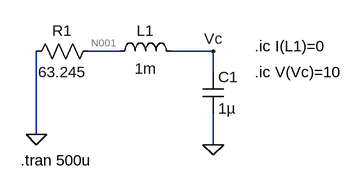
[diagram p0: schematic critically_damped.asc]
critically_damped.asc, the LTspice schematic file:
Version 4
SHEET 1 880 680
WIRE 144 96 96 96
WIRE 288 96 224 96
WIRE 288 128 288 96
WIRE 16 224 16 96
WIRE 288 240 288 192
FLAG 288 240 0
FLAG 16 224 0
FLAG 288 96 Vc
SYMBOL res 112 80 R90
WINDOW 0 0 56 VBottom 2
WINDOW 3 32 56 VTop 2
SYMATTR InstName R1
SYMATTR Value 63.245
SYMBOL ind 128 112 R270
WINDOW 0 32 56 VTop 2
WINDOW 3 5 56 VBottom 2
SYMATTR InstName L1
SYMATTR Value 1m
SYMBOL cap 272 128 R0
SYMATTR InstName C1
SYMATTR Value 1µ
TEXT 352 88 Left 2 !.ic I(L1)=0
TEXT 352 128 Left 2 !.ic V(Vc)=10
TEXT -8 264 Left 2 !.tran 500u

The netlist it stands for:
* critically_damped.asc
R1 N001 0 63.245
L1 N001 Vc 1m
C1 Vc 0 1µ
.ic I(L1)=0
.ic V(Vc)=10
.tran 500u
.backanno
.end

* Results of the author's LTspice run, read from the files saved beside the schematic
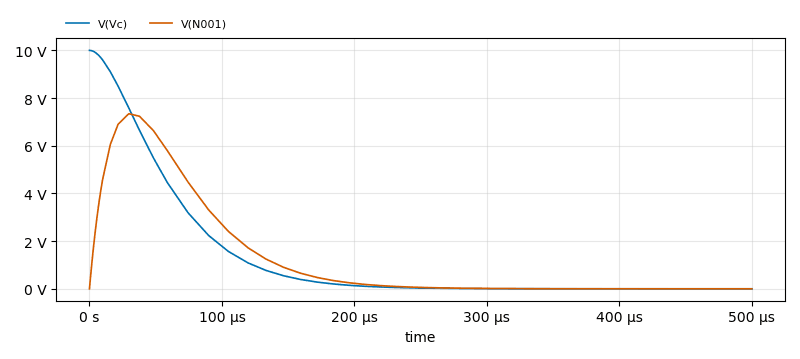
[diagram p1: Transient Analysis of critically_damped.asc, plotted from the saved traces]
* Transient Analysis, 1 run:
*   V(Vc): min 22.85 µV, max 10 V, average 1.268 V, rms 2.82 V, last 22.85 µV
*   V(N001): min 0 V, max 7.344 V, average 1.264 V, rms 2.515 V, last 42.98 µV